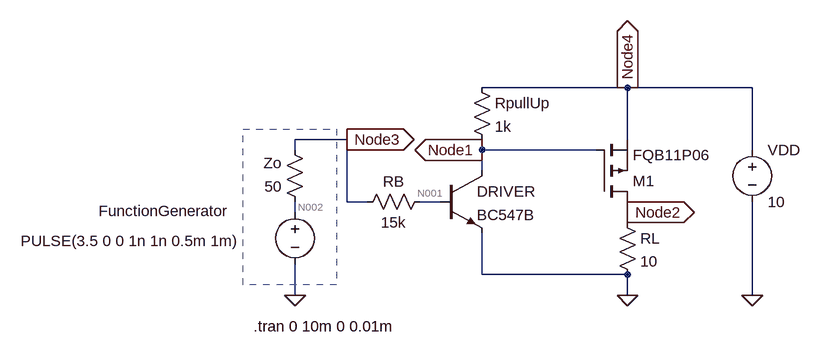
[diagram p0: schematic POE_2025_Powerloss_PMOSFET.asc]
POE_2025_Powerloss_PMOSFET.asc, the LTspice schematic file:
Version 4
SHEET 1 880 680
WIRE 368 -80 144 -80
WIRE 560 -80 368 -80
WIRE -64 0 -144 0
WIRE 368 0 368 -80
WIRE -144 16 -144 0
WIRE 144 16 144 0
WIRE 320 16 144 16
WIRE 560 16 560 -80
WIRE 144 48 144 16
WIRE -64 96 -64 0
WIRE -32 96 -64 96
WIRE 80 96 48 96
WIRE -144 112 -144 96
WIRE 368 112 368 96
WIRE 368 128 368 112
WIRE 144 208 144 144
WIRE 368 208 144 208
WIRE -144 240 -144 192
WIRE 368 240 368 208
WIRE 560 240 560 96
FLAG 368 240 0
FLAG 560 240 0
FLAG -144 240 0
FLAG 144 16 Node1
IOPIN 144 16 Out
FLAG 368 112 Node2
IOPIN 368 112 Out
FLAG -64 0 Node3
IOPIN -64 0 Out
FLAG 368 -80 Node4
IOPIN 368 -80 Out
SYMBOL pmos 320 96 M180
SYMATTR InstName M1
SYMATTR Value FQB11P06
SYMBOL voltage 560 0 R0
SYMATTR InstName VDD
SYMATTR Value 10
SYMBOL voltage -144 96 R0
WINDOW 0 -302 14 Left 2
WINDOW 3 -422 60 Left 2
WINDOW 123 0 0 Left 2
WINDOW 39 0 0 Left 2
SYMATTR InstName FunctionGenerator
SYMATTR Value PULSE(3.5 0 0 1n 1n 0.5m 1m)
SYMBOL res 128 -96 R0
SYMATTR InstName RpullUp
SYMATTR Value 1k
SYMBOL res -128 112 R180
WINDOW 0 36 76 Left 2
WINDOW 3 36 40 Left 2
SYMATTR InstName Zo
SYMATTR Value 50
SYMBOL res 352 112 R0
SYMATTR InstName RL
SYMATTR Value 10
SYMBOL npn 80 48 R0
SYMATTR InstName DRIVER
SYMATTR Value BC547B
SYMBOL res 64 80 R90
WINDOW 0 0 56 VBottom 2
WINDOW 3 32 56 VTop 2
SYMATTR InstName RB
SYMATTR Value 15k
TEXT -208 288 Left 2 !.tran 0 10m 0 0.01m
RECTANGLE Normal -80 224 -224 -16 2

The netlist it stands for:
* POE_2025_Powerloss_PMOSFET.asc
M1 Node2 Node1 Node4 Node4 FQB11P06
VDD Node4 0 10
V§FunctionGenerator N002 0 PULSE(3.5 0 0 1n 1n 0.5m 1m)
RpullUp Node4 Node1 1k
R§Zo N002 Node3 50
RL Node2 0 10
Q§DRIVER Node1 N001 0 0 BC547B
RB N001 Node3 15k
.model NPN NPN
.model PNP PNP
.lib standard.bjt
.model NMOS NMOS
.model PMOS PMOS
.lib standard.mos
.tran 0 10m 0 0.01m
.backanno
.end

* Results of the author's LTspice run, read from the files saved beside the schematic
* Operating Point, zero values left out:
*   V(node2) = 9.852 V
*   V(node1) = 82.4 mV
*   V(node4) = 10 V
*   V(n002) = 3.5 V
*   V(node3) = 3.491 V
*   V(n001) = 708.1 mV
*   Ic(Driver) = 9.918 mA
*   Ib(Driver) = 185.5 µA
*   Ie(Driver) = -10.1 mA
*   Id(M1) = -985.2 mA
*   Is(M1) = 985.2 mA
*   I(Rpullup) = 9.918 mA
*   I(Zo) = 185.5 µA
*   I(Rl) = 985.2 mA
*   I(Rb) = -185.5 µA
*   I(Vdd) = -995.1 mA
*   I(Functiongenerator) = -185.5 µA
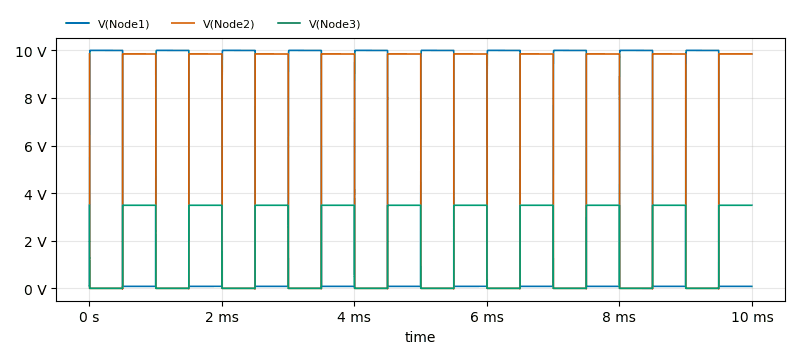
[diagram p1: Transient Analysis of POE_2025_Powerloss_PMOSFET.asc, plotted from the saved traces]
* Transient Analysis, 1 run:
*   V(Node1): min 66.86 mV, max 10 V, average 5.029 V, rms 7.057 V, last 82.4 mV
*   V(Node2): min -19.9 mV, max 9.852 V, average 4.94 V, rms 6.975 V, last 9.852 V
*   V(Node3): min -356.4 nV, max 3.491 V, average 1.745 V, rms 2.468 V, last 3.491 V